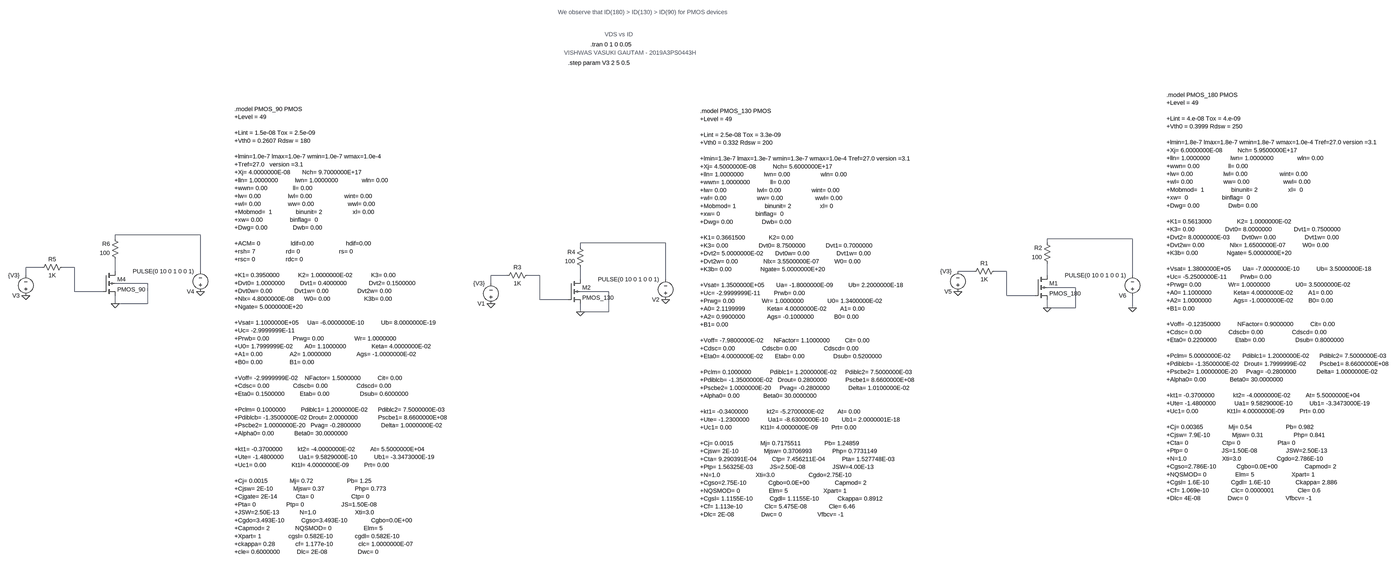
[diagram p0: schematic PMOS_IDvsVDS.asc, whole sheet]
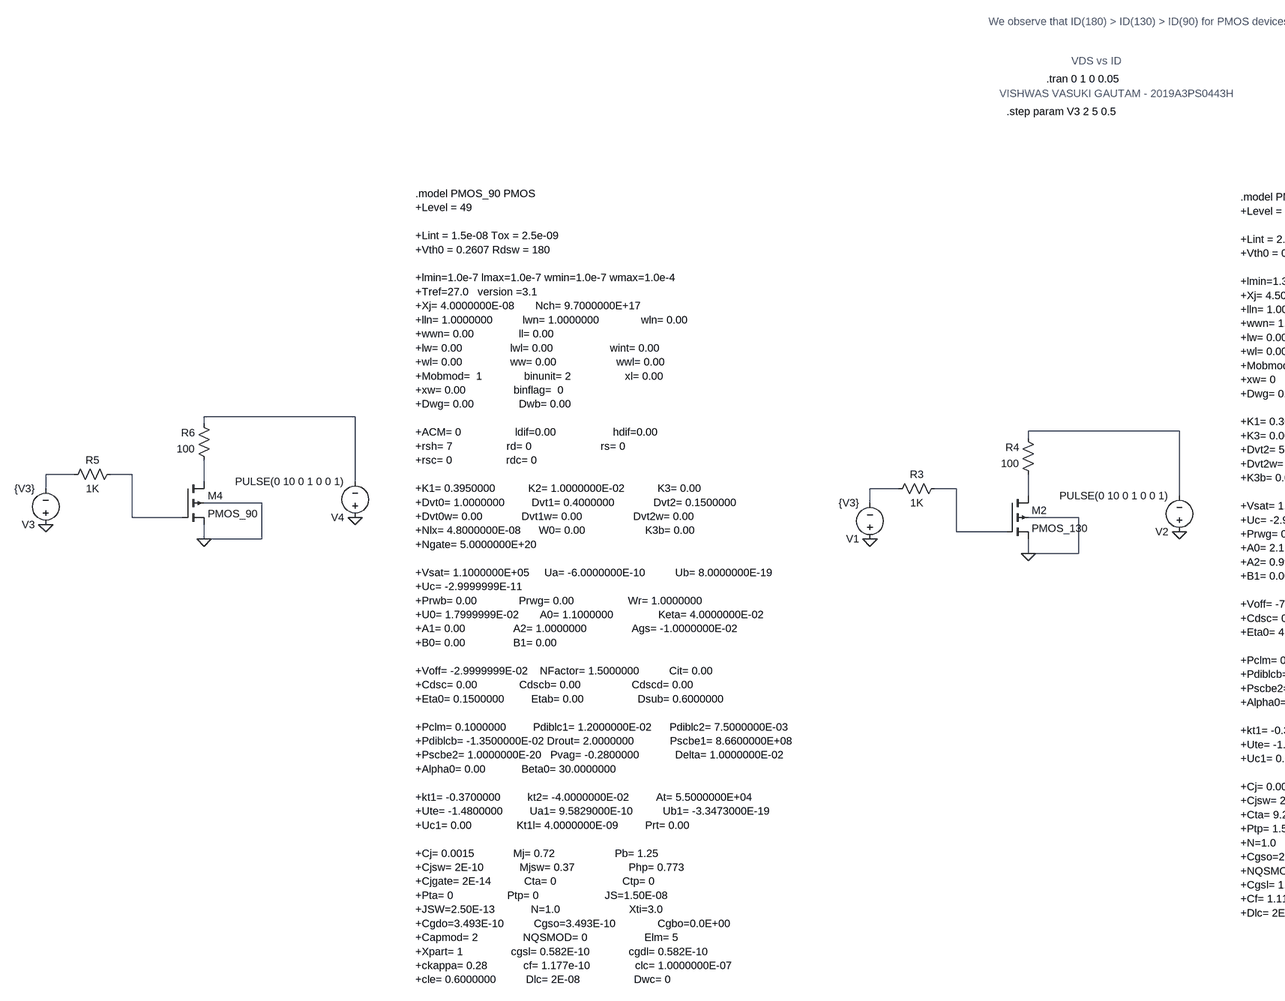
[diagram p1: schematic PMOS_IDvsVDS.asc, part, row 1 of 1, column 1 of 2]
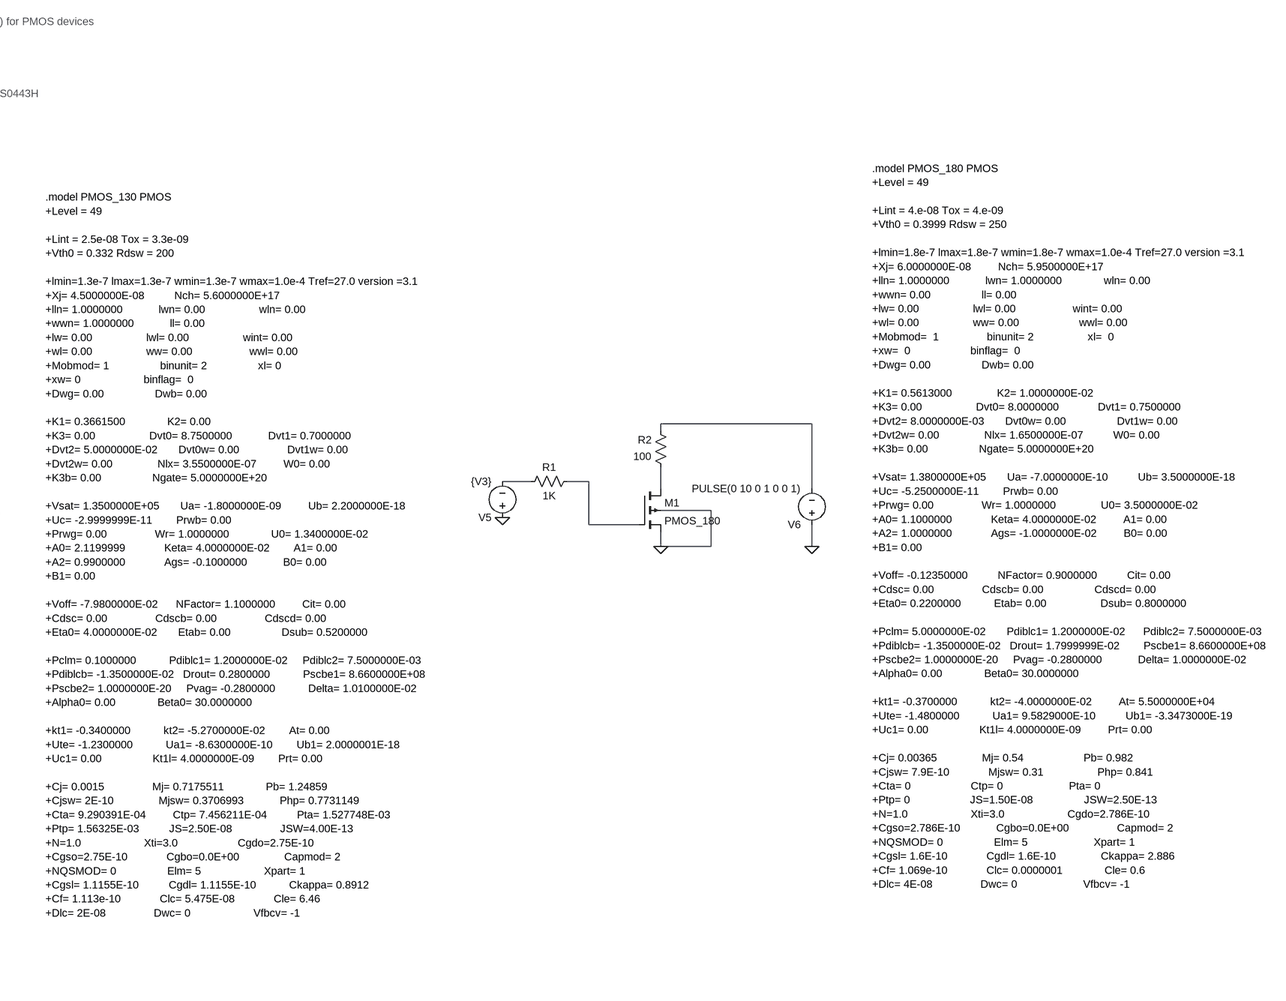
[diagram p2: schematic PMOS_IDvsVDS.asc, part, row 1 of 1, column 2 of 2]
PMOS_IDvsVDS.asc, the LTspice schematic file:
Version 4
SHEET 1 880 680
WIRE -6400 -2256 -6736 -2256
WIRE -6736 -2240 -6736 -2256
WIRE -1840 -2240 -2176 -2240
WIRE -4256 -2224 -4592 -2224
WIRE -2176 -2224 -2176 -2240
WIRE -4592 -2208 -4592 -2224
WIRE -7024 -2128 -7088 -2128
WIRE -6896 -2128 -6944 -2128
WIRE -6736 -2112 -6736 -2160
WIRE -6400 -2112 -6400 -2256
WIRE -2464 -2112 -2528 -2112
WIRE -2336 -2112 -2384 -2112
WIRE -7088 -2096 -7088 -2128
WIRE -4880 -2096 -4944 -2096
WIRE -4752 -2096 -4800 -2096
WIRE -2176 -2096 -2176 -2144
WIRE -1840 -2096 -1840 -2240
WIRE -4592 -2080 -4592 -2128
WIRE -4256 -2080 -4256 -2224
WIRE -6608 -2064 -6736 -2064
WIRE -4944 -2064 -4944 -2096
WIRE -2064 -2048 -2176 -2048
WIRE -6896 -2032 -6896 -2128
WIRE -6784 -2032 -6896 -2032
WIRE -4480 -2032 -4592 -2032
WIRE -2336 -2016 -2336 -2112
WIRE -2224 -2016 -2336 -2016
WIRE -4752 -2000 -4752 -2096
WIRE -4640 -2000 -4752 -2000
WIRE -6736 -1984 -6736 -2016
WIRE -6608 -1984 -6608 -2064
WIRE -6608 -1984 -6736 -1984
WIRE -2176 -1968 -2176 -2000
WIRE -2064 -1968 -2064 -2048
WIRE -2064 -1968 -2176 -1968
WIRE -1840 -1968 -1840 -2016
WIRE -4592 -1952 -4592 -1984
WIRE -4480 -1952 -4480 -2032
WIRE -4480 -1952 -4592 -1952
FLAG -2528 -2032 0
FLAG -2176 -1968 0
FLAG -1840 -1968 0
FLAG -4592 -1952 0
FLAG -4256 -2000 0
FLAG -4944 -1984 0
FLAG -7088 -2016 0
FLAG -6736 -1984 0
FLAG -6400 -2032 0
SYMBOL res -2368 -2128 R90
WINDOW 0 0 56 VBottom 2
WINDOW 3 32 56 VTop 2
SYMATTR InstName R1
SYMATTR Value 1K
SYMBOL res -2160 -2128 R180
WINDOW 0 36 76 Left 2
WINDOW 3 36 40 Left 2
SYMATTR InstName R2
SYMATTR Value 100
SYMBOL res -4784 -2112 R90
WINDOW 0 0 56 VBottom 2
WINDOW 3 32 56 VTop 2
SYMATTR InstName R3
SYMATTR Value 1K
SYMBOL res -4576 -2112 R180
WINDOW 0 36 76 Left 2
WINDOW 3 36 40 Left 2
SYMATTR InstName R4
SYMATTR Value 100
SYMBOL voltage -4944 -1968 R180
WINDOW 123 0 0 Left 2
WINDOW 39 0 0 Left 2
SYMATTR InstName V1
SYMATTR Value {V3}
SYMBOL voltage -4256 -1984 R180
WINDOW 123 0 0 Left 2
WINDOW 39 0 0 Left 2
SYMATTR InstName V2
SYMATTR Value PULSE(0 10 0 1 0 0 1)
SYMBOL res -6928 -2144 R90
WINDOW 0 0 56 VBottom 2
WINDOW 3 32 56 VTop 2
SYMATTR InstName R5
SYMATTR Value 1K
SYMBOL res -6720 -2144 R180
WINDOW 0 36 76 Left 2
WINDOW 3 36 40 Left 2
SYMATTR InstName R6
SYMATTR Value 100
SYMBOL voltage -7088 -2000 R180
WINDOW 123 0 0 Left 2
WINDOW 39 0 0 Left 2
SYMATTR InstName V3
SYMATTR Value {V3}
SYMBOL voltage -6400 -2016 R180
WINDOW 123 0 0 Left 2
WINDOW 39 0 0 Left 2
SYMATTR InstName V4
SYMATTR Value PULSE(0 10 0 1 0 0 1)
SYMBOL voltage -2528 -2016 R180
WINDOW 123 0 0 Left 2
WINDOW 39 0 0 Left 2
SYMATTR InstName V5
SYMATTR Value {V3}
SYMBOL voltage -1840 -2000 R180
WINDOW 123 0 0 Left 2
WINDOW 39 0 0 Left 2
SYMATTR InstName V6
SYMATTR Value PULSE(0 10 0 1 0 0 1)
SYMBOL pmos4 -6784 -2112 R0
SYMATTR InstName M4
SYMATTR Value PMOS_90
SYMBOL pmos4 -4640 -2080 R0
SYMATTR InstName M2
SYMATTR Value PMOS_130
SYMBOL pmos4 -2224 -2096 R0
SYMATTR InstName M1
SYMATTR Value PMOS_180
TEXT -4552 -3280 Left 2 !.tran 0 1 0 0.05
TEXT -4640 -3208 Left 2 !.step param V3 2 5 0.5
TEXT -4680 -3408 Left 2 ;We observe that ID(180) > ID(130) > ID(90) for PMOS devices
TEXT -4496 -3320 Left 2 ;VDS vs ID
TEXT -1688 -2808 Left 2 !.model PMOS_180 PMOS\n+Level = 49\n \n+Lint = 4.e-08 Tox = 4.e-09 \n+Vth0 = 0.3999 Rdsw = 250 \n \n+lmin=1.8e-7 lmax=1.8e-7 wmin=1.8e-7 wmax=1.0e-4 Tref=27.0 version =3.1\n+Xj= 6.0000000E-08         Nch= 5.9500000E+17 \n+lln= 1.0000000            lwn= 1.0000000              wln= 0.00\n+wwn= 0.00                 ll= 0.00\n+lw= 0.00                  lwl= 0.00                   wint= 0.00\n+wl= 0.00                  ww= 0.00                    wwl= 0.00\n+Mobmod=  1                binunit= 2                  xl=  0\n+xw=  0                    binflag=  0\n+Dwg= 0.00                 Dwb= 0.00 \n \n+K1= 0.5613000               K2= 1.0000000E-02 \n+K3= 0.00                  Dvt0= 8.0000000             Dvt1= 0.7500000 \n+Dvt2= 8.0000000E-03       Dvt0w= 0.00                 Dvt1w= 0.00 \n+Dvt2w= 0.00               Nlx= 1.6500000E-07          W0= 0.00 \n+K3b= 0.00                 Ngate= 5.0000000E+20 \n \n+Vsat= 1.3800000E+05       Ua= -7.0000000E-10          Ub= 3.5000000E-18 \n+Uc= -5.2500000E-11        Prwb= 0.00 \n+Prwg= 0.00                Wr= 1.0000000               U0= 3.5000000E-02 \n+A0= 1.1000000             Keta= 4.0000000E-02         A1= 0.00 \n+A2= 1.0000000             Ags= -1.0000000E-02         B0= 0.00 \n+B1= 0.00 \n \n+Voff= -0.12350000          NFactor= 0.9000000          Cit= 0.00 \n+Cdsc= 0.00                Cdscb= 0.00                 Cdscd= 0.00 \n+Eta0= 0.2200000           Etab= 0.00                  Dsub= 0.8000000 \n \n+Pclm= 5.0000000E-02       Pdiblc1= 1.2000000E-02      Pdiblc2= 7.5000000E-03 \n+Pdiblcb= -1.3500000E-02   Drout= 1.7999999E-02        Pscbe1= 8.6600000E+08 \n+Pscbe2= 1.0000000E-20     Pvag= -0.2800000            Delta= 1.0000000E-02 \n+Alpha0= 0.00              Beta0= 30.0000000 \n \n+kt1= -0.3700000           kt2= -4.0000000E-02         At= 5.5000000E+04 \n+Ute= -1.4800000           Ua1= 9.5829000E-10          Ub1= -3.3473000E-19 \n+Uc1= 0.00                 Kt1l= 4.0000000E-09         Prt= 0.00 \n \n+Cj= 0.00365               Mj= 0.54                    Pb= 0.982\n+Cjsw= 7.9E-10             Mjsw= 0.31                  Php= 0.841\n+Cta= 0                    Ctp= 0                      Pta= 0\n+Ptp= 0                    JS=1.50E-08                 JSW=2.50E-13\n+N=1.0                     Xti=3.0                     Cgdo=2.786E-10\n+Cgso=2.786E-10            Cgbo=0.0E+00                Capmod= 2\n+NQSMOD= 0                 Elm= 5                      Xpart= 1\n+Cgsl= 1.6E-10             Cgdl= 1.6E-10               Ckappa= 2.886\n+Cf= 1.069e-10             Clc= 0.0000001              Cle= 0.6\n+Dlc= 4E-08                Dwc= 0                      Vfbcv= -1
TEXT -4120 -2744 Left 2 !.model PMOS_130 PMOS\n+Level = 49\n \n+Lint = 2.5e-08 Tox = 3.3e-09 \n+Vth0 = 0.332 Rdsw = 200 \n \n+lmin=1.3e-7 lmax=1.3e-7 wmin=1.3e-7 wmax=1.0e-4 Tref=27.0 version =3.1\n+Xj= 4.5000000E-08          Nch= 5.6000000E+17 \n+lln= 1.0000000            lwn= 0.00                  wln= 0.00\n+wwn= 1.0000000            ll= 0.00\n+lw= 0.00                  lwl= 0.00                  wint= 0.00\n+wl= 0.00                  ww= 0.00                   wwl= 0.00\n+Mobmod= 1                 binunit= 2                 xl= 0\n+xw= 0                     binflag=  0\n+Dwg= 0.00                 Dwb= 0.00 \n \n+K1= 0.3661500              K2= 0.00 \n+K3= 0.00                  Dvt0= 8.7500000            Dvt1= 0.7000000 \n+Dvt2= 5.0000000E-02       Dvt0w= 0.00                Dvt1w= 0.00 \n+Dvt2w= 0.00               Nlx= 3.5500000E-07         W0= 0.00 \n+K3b= 0.00                 Ngate= 5.0000000E+20 \n \n+Vsat= 1.3500000E+05       Ua= -1.8000000E-09         Ub= 2.2000000E-18 \n+Uc= -2.9999999E-11        Prwb= 0.00 \n+Prwg= 0.00                Wr= 1.0000000              U0= 1.3400000E-02 \n+A0= 2.1199999             Keta= 4.0000000E-02        A1= 0.00 \n+A2= 0.9900000             Ags= -0.1000000            B0= 0.00 \n+B1= 0.00 \n \n+Voff= -7.9800000E-02      NFactor= 1.1000000         Cit= 0.00 \n+Cdsc= 0.00                Cdscb= 0.00                Cdscd= 0.00 \n+Eta0= 4.0000000E-02       Etab= 0.00                 Dsub= 0.5200000 \n \n+Pclm= 0.1000000           Pdiblc1= 1.2000000E-02     Pdiblc2= 7.5000000E-03 \n+Pdiblcb= -1.3500000E-02   Drout= 0.2800000           Pscbe1= 8.6600000E+08 \n+Pscbe2= 1.0000000E-20     Pvag= -0.2800000           Delta= 1.0100000E-02 \n+Alpha0= 0.00              Beta0= 30.0000000 \n \n+kt1= -0.3400000           kt2= -5.2700000E-02        At= 0.00 \n+Ute= -1.2300000           Ua1= -8.6300000E-10        Ub1= 2.0000001E-18 \n+Uc1= 0.00                 Kt1l= 4.0000000E-09        Prt= 0.00 \n \n+Cj= 0.0015                Mj= 0.7175511              Pb= 1.24859\n+Cjsw= 2E-10               Mjsw= 0.3706993            Php= 0.7731149\n+Cta= 9.290391E-04         Ctp= 7.456211E-04          Pta= 1.527748E-03\n+Ptp= 1.56325E-03          JS=2.50E-08                JSW=4.00E-13\n+N=1.0                     Xti=3.0                    Cgdo=2.75E-10\n+Cgso=2.75E-10             Cgbo=0.0E+00               Capmod= 2\n+NQSMOD= 0                 Elm= 5                     Xpart= 1\n+Cgsl= 1.1155E-10          Cgdl= 1.1155E-10           Ckappa= 0.8912\n+Cf= 1.113e-10             Clc= 5.475E-08             Cle= 6.46\n+Dlc= 2E-08                Dwc= 0                     Vfbcv= -1
TEXT -6256 -2752 Left 2 !.model PMOS_90 PMOS\n+Level = 49\n \n+Lint = 1.5e-08 Tox = 2.5e-09 \n+Vth0 = 0.2607 Rdsw = 180 \n \n+lmin=1.0e-7 lmax=1.0e-7 wmin=1.0e-7 wmax=1.0e-4\n+Tref=27.0   version =3.1\n+Xj= 4.0000000E-08       Nch= 9.7000000E+17 \n+lln= 1.0000000          lwn= 1.0000000              wln= 0.00\n+wwn= 0.00               ll= 0.00\n+lw= 0.00                lwl= 0.00                   wint= 0.00\n+wl= 0.00                ww= 0.00                    wwl= 0.00\n+Mobmod=  1              binunit= 2                  xl= 0.00\n+xw= 0.00                binflag=  0\n+Dwg= 0.00               Dwb= 0.00 \n \n+ACM= 0                  ldif=0.00                   hdif=0.00\n+rsh= 7                  rd= 0                       rs= 0\n+rsc= 0                  rdc= 0\n \n+K1= 0.3950000           K2= 1.0000000E-02           K3= 0.00 \n+Dvt0= 1.0000000         Dvt1= 0.4000000             Dvt2= 0.1500000 \n+Dvt0w= 0.00             Dvt1w= 0.00                 Dvt2w= 0.00 \n+Nlx= 4.8000000E-08      W0= 0.00                    K3b= 0.00 \n+Ngate= 5.0000000E+20 \n \n+Vsat= 1.1000000E+05     Ua= -6.0000000E-10          Ub= 8.0000000E-19 \n+Uc= -2.9999999E-11       \n+Prwb= 0.00              Prwg= 0.00                  Wr= 1.0000000 \n+U0= 1.7999999E-02       A0= 1.1000000               Keta= 4.0000000E-02 \n+A1= 0.00                A2= 1.0000000               Ags= -1.0000000E-02\n+B0= 0.00                B1= 0.00 \n \n+Voff= -2.9999999E-02    NFactor= 1.5000000          Cit= 0.00 \n+Cdsc= 0.00              Cdscb= 0.00                 Cdscd= 0.00 \n+Eta0= 0.1500000         Etab= 0.00                  Dsub= 0.6000000 \n \n+Pclm= 0.1000000         Pdiblc1= 1.2000000E-02      Pdiblc2= 7.5000000E-03\n+Pdiblcb= -1.3500000E-02 Drout= 2.0000000            Pscbe1= 8.6600000E+08\n+Pscbe2= 1.0000000E-20   Pvag= -0.2800000            Delta= 1.0000000E-02\n+Alpha0= 0.00            Beta0= 30.0000000 \n \n+kt1= -0.3700000         kt2= -4.0000000E-02         At= 5.5000000E+04 \n+Ute= -1.4800000         Ua1= 9.5829000E-10          Ub1= -3.3473000E-19\n+Uc1= 0.00               Kt1l= 4.0000000E-09         Prt= 0.00 \n \n+Cj= 0.0015             Mj= 0.72                    Pb= 1.25 \n+Cjsw= 2E-10            Mjsw= 0.37                  Php= 0.773\n+Cjgate= 2E-14           Cta= 0                      Ctp= 0\n+Pta= 0                  Ptp= 0                      JS=1.50E-08\n+JSW=2.50E-13            N=1.0                       Xti=3.0\n+Cgdo=3.493E-10          Cgso=3.493E-10              Cgbo=0.0E+00\n+Capmod= 2               NQSMOD= 0                   Elm= 5\n+Xpart= 1                cgsl= 0.582E-10             cgdl= 0.582E-10\n+ckappa= 0.28            cf= 1.177e-10               clc= 1.0000000E-07\n+cle= 0.6000000          Dlc= 2E-08                  Dwc= 0
TEXT -4656 -3248 Left 2 ;VISHWAS VASUKI GAUTAM - 2019A3PS0443H

The netlist it stands for:
* PMOS_IDvsVDS.asc
R1 N008 N007 1K
R2 N011 N002 100
R3 N010 N009 1K
R4 N012 N003 100
V1 0 N009 {V3}
V2 0 N003 PULSE(0 10 0 1 0 0 1)
R5 N005 N004 1K
R6 N006 N001 100
V3 0 N004 {V3}
V4 0 N001 PULSE(0 10 0 1 0 0 1)
V5 0 N007 {V3}
V6 0 N002 PULSE(0 10 0 1 0 0 1)
M4 N006 N005 0 0 PMOS_90
M2 N012 N010 0 0 PMOS_130
M1 N011 N008 0 0 PMOS_180
.model NMOS NMOS
.model PMOS PMOS
.lib standard.mos
.tran 0 1 0 0.05
.step param V3 2 5 0.5
* We observe that ID(180) > ID(130) > ID(90) for PMOS devices
* VDS vs ID
.model PMOS_180 PMOS
+Level = 49
+Lint = 4.e-08 Tox = 4.e-09
+Vth0 = 0.3999 Rdsw = 250
+lmin=1.8e-7 lmax=1.8e-7 wmin=1.8e-7 wmax=1.0e-4 Tref=27.0 version =3.1
+Xj= 6.0000000E-08         Nch= 5.9500000E+17
+lln= 1.0000000            lwn= 1.0000000              wln= 0.00
+wwn= 0.00                 ll= 0.00
+lw= 0.00                  lwl= 0.00                   wint= 0.00
+wl= 0.00                  ww= 0.00                    wwl= 0.00
+Mobmod=  1                binunit= 2                  xl=  0
+xw=  0                    binflag=  0
+Dwg= 0.00                 Dwb= 0.00
+K1= 0.5613000               K2= 1.0000000E-02
+K3= 0.00                  Dvt0= 8.0000000             Dvt1= 0.7500000
+Dvt2= 8.0000000E-03       Dvt0w= 0.00                 Dvt1w= 0.00
+Dvt2w= 0.00               Nlx= 1.6500000E-07          W0= 0.00
+K3b= 0.00                 Ngate= 5.0000000E+20
+Vsat= 1.3800000E+05       Ua= -7.0000000E-10          Ub= 3.5000000E-18
+Uc= -5.2500000E-11        Prwb= 0.00
+Prwg= 0.00                Wr= 1.0000000               U0= 3.5000000E-02
+A0= 1.1000000             Keta= 4.0000000E-02         A1= 0.00
+A2= 1.0000000             Ags= -1.0000000E-02         B0= 0.00
+B1= 0.00
+Voff= -0.12350000          NFactor= 0.9000000          Cit= 0.00
+Cdsc= 0.00                Cdscb= 0.00                 Cdscd= 0.00
+Eta0= 0.2200000           Etab= 0.00                  Dsub= 0.8000000
+Pclm= 5.0000000E-02       Pdiblc1= 1.2000000E-02      Pdiblc2= 7.5000000E-03
+Pdiblcb= -1.3500000E-02   Drout= 1.7999999E-02        Pscbe1= 8.6600000E+08
+Pscbe2= 1.0000000E-20     Pvag= -0.2800000            Delta= 1.0000000E-02
+Alpha0= 0.00              Beta0= 30.0000000
+kt1= -0.3700000           kt2= -4.0000000E-02         At= 5.5000000E+04
+Ute= -1.4800000           Ua1= 9.5829000E-10          Ub1= -3.3473000E-19
+Uc1= 0.00                 Kt1l= 4.0000000E-09         Prt= 0.00
+Cj= 0.00365               Mj= 0.54                    Pb= 0.982
+Cjsw= 7.9E-10             Mjsw= 0.31                  Php= 0.841
+Cta= 0                    Ctp= 0                      Pta= 0
+Ptp= 0                    JS=1.50E-08                 JSW=2.50E-13
+N=1.0                     Xti=3.0                     Cgdo=2.786E-10
+Cgso=2.786E-10            Cgbo=0.0E+00                Capmod= 2
+NQSMOD= 0                 Elm= 5                      Xpart= 1
+Cgsl= 1.6E-10             Cgdl= 1.6E-10               Ckappa= 2.886
+Cf= 1.069e-10             Clc= 0.0000001              Cle= 0.6
+Dlc= 4E-08                Dwc= 0                      Vfbcv= -1
.model PMOS_130 PMOS
+Level = 49
+Lint = 2.5e-08 Tox = 3.3e-09
+Vth0 = 0.332 Rdsw = 200
+lmin=1.3e-7 lmax=1.3e-7 wmin=1.3e-7 wmax=1.0e-4 Tref=27.0 version =3.1
+Xj= 4.5000000E-08          Nch= 5.6000000E+17
+lln= 1.0000000            lwn= 0.00                  wln= 0.00
+wwn= 1.0000000            ll= 0.00
+lw= 0.00                  lwl= 0.00                  wint= 0.00
+wl= 0.00                  ww= 0.00                   wwl= 0.00
+Mobmod= 1                 binunit= 2                 xl= 0
+xw= 0                     binflag=  0
+Dwg= 0.00                 Dwb= 0.00
+K1= 0.3661500              K2= 0.00
+K3= 0.00                  Dvt0= 8.7500000            Dvt1= 0.7000000
+Dvt2= 5.0000000E-02       Dvt0w= 0.00                Dvt1w= 0.00
+Dvt2w= 0.00               Nlx= 3.5500000E-07         W0= 0.00
+K3b= 0.00                 Ngate= 5.0000000E+20
+Vsat= 1.3500000E+05       Ua= -1.8000000E-09         Ub= 2.2000000E-18
+Uc= -2.9999999E-11        Prwb= 0.00
+Prwg= 0.00                Wr= 1.0000000              U0= 1.3400000E-02
+A0= 2.1199999             Keta= 4.0000000E-02        A1= 0.00
+A2= 0.9900000             Ags= -0.1000000            B0= 0.00
+B1= 0.00
+Voff= -7.9800000E-02      NFactor= 1.1000000         Cit= 0.00
+Cdsc= 0.00                Cdscb= 0.00                Cdscd= 0.00
+Eta0= 4.0000000E-02       Etab= 0.00                 Dsub= 0.5200000
+Pclm= 0.1000000           Pdiblc1= 1.2000000E-02     Pdiblc2= 7.5000000E-03
+Pdiblcb= -1.3500000E-02   Drout= 0.2800000           Pscbe1= 8.6600000E+08
+Pscbe2= 1.0000000E-20     Pvag= -0.2800000           Delta= 1.0100000E-02
+Alpha0= 0.00              Beta0= 30.0000000
+kt1= -0.3400000           kt2= -5.2700000E-02        At= 0.00
+Ute= -1.2300000           Ua1= -8.6300000E-10        Ub1= 2.0000001E-18
+Uc1= 0.00                 Kt1l= 4.0000000E-09        Prt= 0.00
+Cj= 0.0015                Mj= 0.7175511              Pb= 1.24859
+Cjsw= 2E-10               Mjsw= 0.3706993            Php= 0.7731149
+Cta= 9.290391E-04         Ctp= 7.456211E-04          Pta= 1.527748E-03
+Ptp= 1.56325E-03          JS=2.50E-08                JSW=4.00E-13
+N=1.0                     Xti=3.0                    Cgdo=2.75E-10
+Cgso=2.75E-10             Cgbo=0.0E+00               Capmod= 2
+NQSMOD= 0                 Elm= 5                     Xpart= 1
+Cgsl= 1.1155E-10          Cgdl= 1.1155E-10           Ckappa= 0.8912
+Cf= 1.113e-10             Clc= 5.475E-08             Cle= 6.46
+Dlc= 2E-08                Dwc= 0                     Vfbcv= -1
.model PMOS_90 PMOS
+Level = 49
+Lint = 1.5e-08 Tox = 2.5e-09
+Vth0 = 0.2607 Rdsw = 180
+lmin=1.0e-7 lmax=1.0e-7 wmin=1.0e-7 wmax=1.0e-4
+Tref=27.0   version =3.1
+Xj= 4.0000000E-08       Nch= 9.7000000E+17
+lln= 1.0000000          lwn= 1.0000000              wln= 0.00
+wwn= 0.00               ll= 0.00
+lw= 0.00                lwl= 0.00                   wint= 0.00
+wl= 0.00                ww= 0.00                    wwl= 0.00
+Mobmod=  1              binunit= 2                  xl= 0.00
+xw= 0.00                binflag=  0
+Dwg= 0.00               Dwb= 0.00
+ACM= 0                  ldif=0.00                   hdif=0.00
+rsh= 7                  rd= 0                       rs= 0
+rsc= 0                  rdc= 0
+K1= 0.3950000           K2= 1.0000000E-02           K3= 0.00
+Dvt0= 1.0000000         Dvt1= 0.4000000             Dvt2= 0.1500000
+Dvt0w= 0.00             Dvt1w= 0.00                 Dvt2w= 0.00
+Nlx= 4.8000000E-08      W0= 0.00                    K3b= 0.00
+Ngate= 5.0000000E+20
+Vsat= 1.1000000E+05     Ua= -6.0000000E-10          Ub= 8.0000000E-19
+Uc= -2.9999999E-11
+Prwb= 0.00              Prwg= 0.00                  Wr= 1.0000000
+U0= 1.7999999E-02       A0= 1.1000000               Keta= 4.0000000E-02
+A1= 0.00                A2= 1.0000000               Ags= -1.0000000E-02
+B0= 0.00                B1= 0.00
+Voff= -2.9999999E-02    NFactor= 1.5000000          Cit= 0.00
+Cdsc= 0.00              Cdscb= 0.00                 Cdscd= 0.00
+Eta0= 0.1500000         Etab= 0.00                  Dsub= 0.6000000
+Pclm= 0.1000000         Pdiblc1= 1.2000000E-02      Pdiblc2= 7.5000000E-03
+Pdiblcb= -1.3500000E-02 Drout= 2.0000000            Pscbe1= 8.6600000E+08
+Pscbe2= 1.0000000E-20   Pvag= -0.2800000            Delta= 1.0000000E-02
+Alpha0= 0.00            Beta0= 30.0000000
+kt1= -0.3700000         kt2= -4.0000000E-02         At= 5.5000000E+04
+Ute= -1.4800000         Ua1= 9.5829000E-10          Ub1= -3.3473000E-19
+Uc1= 0.00               Kt1l= 4.0000000E-09         Prt= 0.00
+Cj= 0.0015             Mj= 0.72                    Pb= 1.25
+Cjsw= 2E-10            Mjsw= 0.37                  Php= 0.773
+Cjgate= 2E-14           Cta= 0                      Ctp= 0
+Pta= 0                  Ptp= 0                      JS=1.50E-08
+JSW=2.50E-13            N=1.0                       Xti=3.0
+Cgdo=3.493E-10          Cgso=3.493E-10              Cgbo=0.0E+00
+Capmod= 2               NQSMOD= 0                   Elm= 5
+Xpart= 1                cgsl= 0.582E-10             cgdl= 0.582E-10
+ckappa= 0.28            cf= 1.177e-10               clc= 1.0000000E-07
+cle= 0.6000000          Dlc= 2E-08                  Dwc= 0
* VISHWAS VASUKI GAUTAM - 2019A3PS0443H
.backanno
.end